# Altium schematic sheet Motors.SchDoc
size A1; SheetNumber: 3; SheetTotal: 4
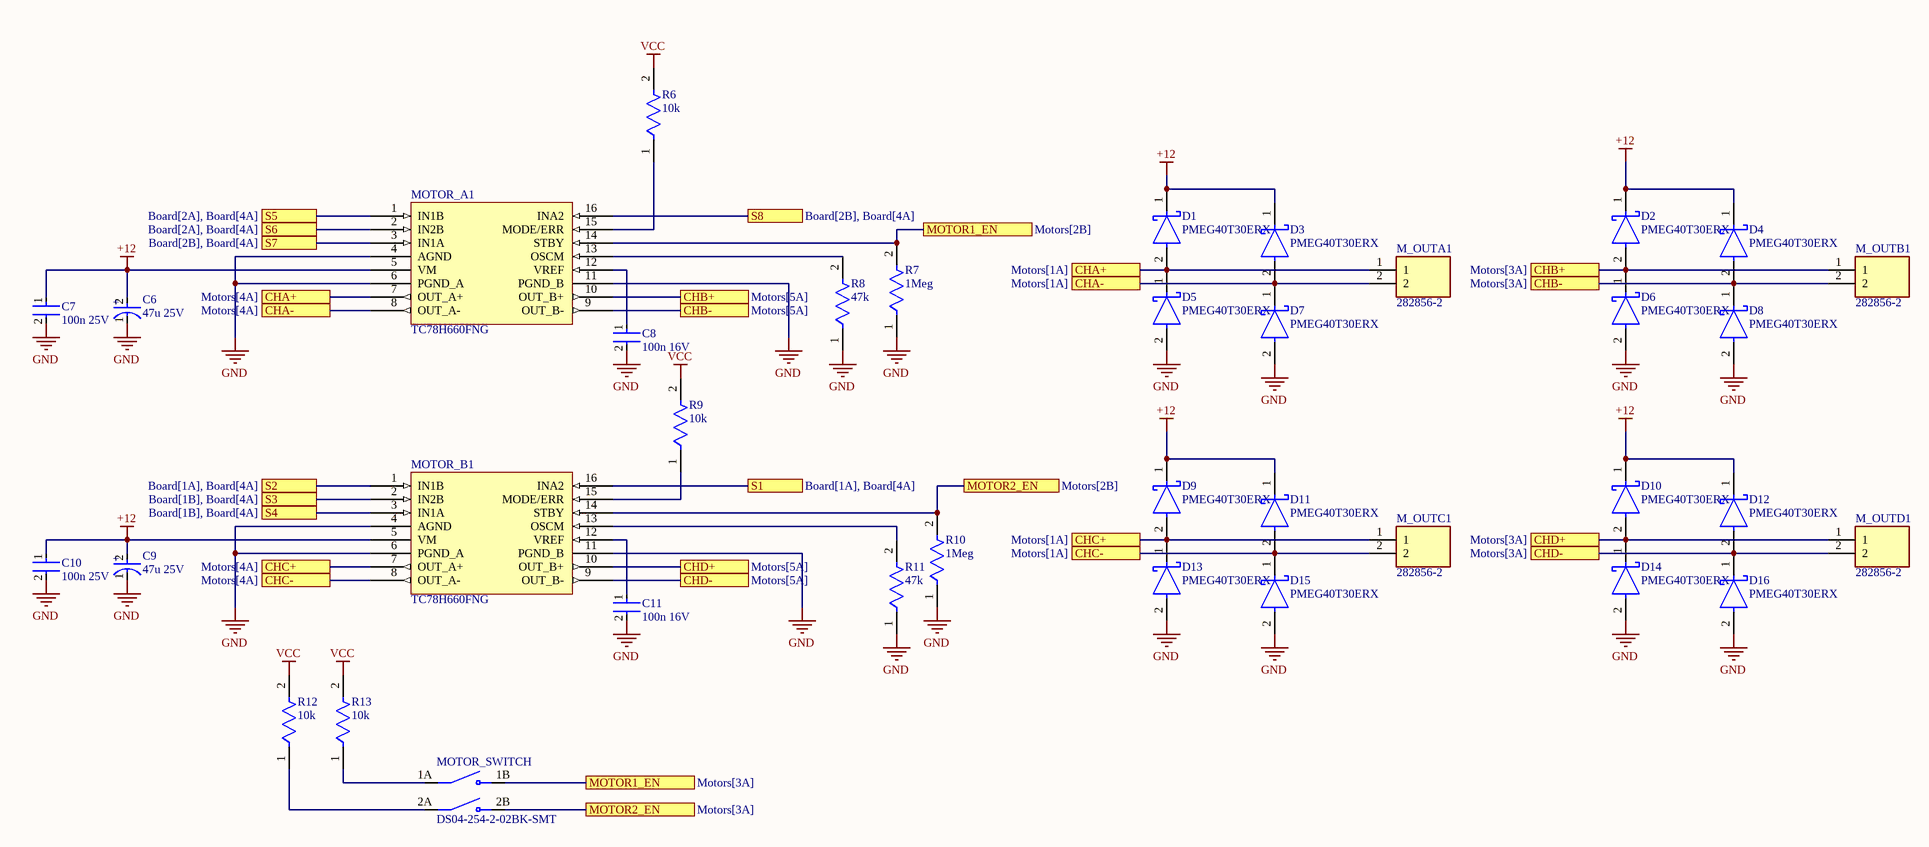
[diagram p0: Motors.SchDoc]

## Parts
C6  47u 25V  [FP-T491D476K025AT-MFG]
C7  100n 25V  [FP-C0402-BB-MFG]
C8  100n 16V  [FP-C0402-BB-MFG]
C9  47u 25V  [FP-T491D476K025AT-MFG]
C10  100n 25V  [FP-C0402-BB-MFG]
C11  100n 16V  [FP-C0402-BB-MFG]
D1  PMEG40T30ERX  [FP-SOD123-IPC_A]
D2  PMEG40T30ERX  [FP-SOD123-IPC_A]
D3  PMEG40T30ERX  [FP-SOD123-IPC_A]
D4  PMEG40T30ERX  [FP-SOD123-IPC_A]
D5  PMEG40T30ERX  [FP-SOD123-IPC_A]
D6  PMEG40T30ERX  [FP-SOD123-IPC_A]
D7  PMEG40T30ERX  [FP-SOD123-IPC_A]
D8  PMEG40T30ERX  [FP-SOD123-IPC_A]
D9  PMEG40T30ERX  [FP-SOD123-IPC_A]
D10  PMEG40T30ERX  [FP-SOD123-IPC_A]
D11  PMEG40T30ERX  [FP-SOD123-IPC_A]
D12  PMEG40T30ERX  [FP-SOD123-IPC_A]
D13  PMEG40T30ERX  [FP-SOD123-IPC_A]
D14  PMEG40T30ERX  [FP-SOD123-IPC_A]
D15  PMEG40T30ERX  [FP-SOD123-IPC_A]
D16  PMEG40T30ERX  [FP-SOD123-IPC_A]
M_OUTA1  282856-2  [TE_282856-2]
M_OUTB1  282856-2  [TE_282856-2]
M_OUTC1  282856-2  [TE_282856-2]
M_OUTD1  282856-2  [TE_282856-2]
MOTOR_A1  TC78H660FNG  [TSOP65P640X120-16N]
MOTOR_B1  TC78H660FNG  [TSOP65P640X120-16N]
MOTOR_SWITCH  DS04-254-2-02BK-SMT  [SW_DS04-254-2-02BK-SMT]
R6  10k  [FP-CRCW0402-e3-IPC_C]
R7  1Meg  [FP-CRCW0402-e3-IPC_C]
R8  47k  [FP-CRCW0402-e3-IPC_C]
R9  10k  [FP-CRCW0402-e3-IPC_C]
R10  1Meg  [FP-CRCW0402-e3-IPC_C]
R11  47k  [FP-CRCW0402-e3-IPC_C]
R12  10k  [FP-CRCW0402-e3-IPC_C]
R13  10k  [FP-CRCW0402-e3-IPC_C]

## Ports
CHA+ (see Motors[1A]), CHA+ (see Motors[4A]), CHA- (see Motors[1A]), CHA- (see Motors[4A]), CHB+ (see Motors[3A]), CHB+ (see Motors[5A]), CHB- (see Motors[3A]), CHB- (see Motors[5A]), CHC+ (see Motors[1A]), CHC+ (see Motors[4A]), CHC- (see Motors[1A]), CHC- (see Motors[4A]), CHD+ (see Motors[3A]), CHD+ (see Motors[5A]), CHD- (see Motors[3A]), CHD- (see Motors[5A]), MOTOR1_EN (see Motors[2B]), MOTOR1_EN (see Motors[3A]), MOTOR2_EN (see Motors[2B]), MOTOR2_EN (see Motors[3A]), S1 (see Board[1A], Board[4A]), S2 (see Board[1A], Board[4A]), S3 (see Board[1B], Board[4A]), S4 (see Board[1B], Board[4A]), S5 (see Board[2A], Board[4A]), S6 (see Board[2A], Board[4A]), S7 (see Board[2B], Board[4A]), S8 (see Board[2B], Board[4A])

## Nets
+12: C6.2(A) C7.1 C9.2(A) C10.1 D1.1(C) D2.1(C) D3.1(C) D4.1(C) D9.1(C) D10.1(C) D11.1(C) D12.1(C) MOTOR_A1.5(VM) MOTOR_B1.5(VM)
GND: C6.1(C) C7.2 C8.2 C9.1(C) C10.2 C11.2 D5.2(A) D6.2(A) D7.2(A) D8.2(A) D13.2(A) D14.2(A) D15.2(A) D16.2(A) MOTOR_A1.4(AGND) MOTOR_A1.6(PGND_A) MOTOR_A1.11(PGND_B) MOTOR_B1.4(AGND) MOTOR_B1.6(PGND_A) MOTOR_B1.11(PGND_B) R7.1 R8.1 R10.1 R11.1
VCC: R6.2 R9.2 R12.2 R13.2
CHA+: D1.2(A) D5.1(C) M_OUTA1.1 MOTOR_A1.7(OUT_A+) ; port CHA+
CHA-: D3.2(A) D7.1(C) M_OUTA1.2 MOTOR_A1.8(OUT_A-) ; port CHA-
CHB+: D2.2(A) D6.1(C) M_OUTB1.1 MOTOR_A1.10(OUT_B+) ; port CHB+
CHB-: D4.2(A) D8.1(C) M_OUTB1.2 MOTOR_A1.9(OUT_B-) ; port CHB-
CHC+: D9.2(A) D13.1(C) M_OUTC1.1 MOTOR_B1.7(OUT_A+) ; port CHC+
CHC-: D11.2(A) D15.1(C) M_OUTC1.2 MOTOR_B1.8(OUT_A-) ; port CHC-
CHD+: D10.2(A) D14.1(C) M_OUTD1.1 MOTOR_B1.10(OUT_B+) ; port CHD+
CHD-: D12.2(A) D16.1(C) M_OUTD1.2 MOTOR_B1.9(OUT_B-) ; port CHD-
MOTOR1_EN: MOTOR_A1.14(STBY) MOTOR_SWITCH.1B(NO1) R7.2 ; port MOTOR1_EN
MOTOR2_EN: MOTOR_B1.14(STBY) MOTOR_SWITCH.2B(NO2) R10.2 ; port MOTOR2_EN
S1: MOTOR_B1.16(INA2) ; port S1
S2: MOTOR_B1.1(IN1B) ; port S2
S3: MOTOR_B1.2(IN2B) ; port S3
S4: MOTOR_B1.3(IN1A) ; port S4
S5: MOTOR_A1.1(IN1B) ; port S5
S6: MOTOR_A1.2(IN2B) ; port S6
S7: MOTOR_A1.3(IN1A) ; port S7
S8: MOTOR_A1.16(INA2) ; port S8
NetC8_1: C8.1 MOTOR_A1.12(VREF)
NetC11_1: C11.1 MOTOR_B1.12(VREF)
NetMOTOR_A1_13: MOTOR_A1.13(OSCM) R8.2
NetMOTOR_A1_15: MOTOR_A1.15(MODE/ERR) R6.1
NetMOTOR_B1_13: MOTOR_B1.13(OSCM) R11.2
NetMOTOR_B1_15: MOTOR_B1.15(MODE/ERR) R9.1
NetMOTOR_SWITCH_1A: MOTOR_SWITCH.1A(COM1) R13.1
NetMOTOR_SWITCH_2A: MOTOR_SWITCH.2A(COM2) R12.1

## Notes on the sheet
- (in symbol CMP-03017-000020-1) +

## Library data of the parts
C6 C9 = CMP-03017-000020-1: CAP TANT 47UF 10% 25V 2917; Dielectric Material: Tantalum; Life (Hours): 2000Hour; Ripple Current: 463mA; Leakage Current: 11.8uA; Polarity: Polar; ESR (Equivalent Series Resistance): 700mR; Height - Seated (Max): 0.122inch; Package Quantity: 1; Max Operating Temperature: 125°C; Failure Rate: 0.001%; Height: 2.8mm; Voltage Rating (DC): 25V; Dissipation Factor: 10%; Mount: Surface Mount; Min Operating Temperature: -55°C; Packaging: Tape and Reel; Radiation Hardening: No; Case Code (Metric): 7343; Features: General Purpose; Voltage: 25V; Case/Package: 2917; Capacitance: 47uF; Case Code (Imperial): 2917; Tolerance: 10%; Number of Pins: 2; Weight: 0.023634oz; REACH SVHC: No SVHC; RoHS Compliant: Yes; Length: 7.3mm; Depth: 4.3mm; Lead Free: Lead Free; Width: 4.3mm; Voltage Rating: 25V; Termination: SMD/SMT
C7 C8 C10 C11 = CMP-2008-02108-2: CAP CER 0.1UF 16V X7R 0402; Manufacturer: Kemet; Manufacturer Part Number: C0402C104K4RACTU; Value: 0.10 μF; Tolerance: 0.1; Material: Ceramic; Temperature Coefficient: 15%; Voltage Rating: 16 V; Package: C0402-BB; Automotive: No; Ipc Land Pattern Name: CAPC10050X50; Device Class L3: Ceramic Capacitors; Capacitance: 0.10 μF; Octopart: https://octopart.com/c0402c104k4ractu-kemet-94158; Temperature Characteristic: X7R; Mouser Description: Cap Ceramic 0.1uF 16V X7R 10% SMD 0402 125?C Paper T/R - Tape and Reel (Alt: C0402C104K4RAC TU); ComponentLink2Description: Datasheet; Temperature Range Low: -55°C; RoHS: TRUE; Device Class L1: Passive Components; Temperature Range High: +125°C; Device Class L2: Capacitors; ComponentLink2URL: https://content.kemet.com/datasheets/KEM_C1002_X7R_SMD.pdf; Category: Cap; Height: 0.55mm; Temperature: -55°C to +125°C; Lead Free: Yes; Digikey Description: CAP CER 0.1UF 16V X7R 0402
D1-D16 = CMP-0303-00003-3: DIODE SCHOTTKY 40V 1A SOD123; Forward Voltage: 450mV; Capacitance: 110pF; Max Forward Surge Current (Ifsm): 25A; Peak Reverse Current: 50uA; Polarity: Standard; Element Configuration: Single; Max Power Dissipation: 450mW; Min Operating Temperature: -65°C; Package Quantity: 3000; Contact Plating: Tin; Weight: 0.000353oz; Max Repetitive Reverse Voltage (Vrrm): 40V; Max Reverse Voltage (DC): 40V; Height: 1.25mm; Average Rectified Current: 1A; Width: 1.7mm; Case/Package: SOD-123-2; Lead Free: Lead Free; Max Operating Temperature: 125°C; Current Rating: 1A; Termination: SMD/SMT; Forward Current: 1A; Radiation Hardening: No; Number of Pins: 2; Length: 2.85mm; Voltage Rating (DC): 40V; REACH SVHC: No SVHC; Peak Non-Repetitive Surge Current: 25A; Packaging: Tape and Reel; Output Current: 1A
M_OUTA1 M_OUTB1 M_OUTC1 M_OUTD1 = CMP-036-000000-1: TERMI-BLOK PCB MOUNT 2P; MF: TE Connectivity; Design Item ID: 282856-2; Component Type: Standard; Package: None; Value: *; EU_RoHS_Compliance: Compliant with Exemptions; SnapEDA_Link: https://www.snapeda.com/parts/282856-2/TE%20Connectivity%20AMP%20Connectors/view-part/1809079/?ref=snap; Digi-Key_Purchase_URL: https://www.digikey.com/product-detail/en/te-connectivity-amp-connectors/1-282856-2/A98108-ND/1826971?utm_source=snapeda&utm_medium=aggregator&utm_campaign=symbol; Digi-Key_Part_Number: A98108-ND; TE_purchase_URL: https://www.te.com/usa-en/product-282856-2.html?te_bu=Cor&te_type=disp&te_campaign=seda_glo_cor-seda-global-disp-prtnr-fy19-seda-model-bom-cta_sma-317_1&elqCampaignId=32493; Pin Count: 2; MP: 282856-2; Source: SnapEDAsch.SchLib
MOTOR_A1 MOTOR_B1 = CMP-024-00000-1: Toshiba two channel dc motor driver , 2A for each channel.
MOTOR_SWITCH = CMP-038-000000-1: 2 Position, Surface Mount, 2.54 mm Pitch, Flat Slide Actuator, Flat Bottom, SMT Pin, DIP Switch; MF: CUI Devices; Value: *; SnapEDA_Link: https://www.snapeda.com/parts/DS04-254-2-02BK-SMT/CUI+Devices/view-part/?ref=snap; Digi-Key_Part_Number: 2223-DS04-254-2-02BK-SMT-ND; CUI_purchase_URL: https://www.cuidevices.com/product/switches/dip-switches/ds04-254-smt-series?utm_source=snapeda.com&utm_medium=referral&utm_campaign=snapedaBOM; Package: None; Purchase-URL: https://pricing.snapeda.com/search/part/DS04-254-2-02BK-SMT/?ref=eda; MP: DS04-254-2-02BK-SMT; Source: DS04-254-2-02BK-SMT.SchLib; Pin Count: 4; Design Item ID: DS04-254-2-02BK-SMT; Component Type: Standard; Check_prices: https://www.snapeda.com/parts/DS04-254-2-02BK-SMT/CUI+Devices/view-part/?ref=eda
R6-R13 = CMP-2002-08122-2: RES Thick Film, 0Ω, 0.063W, 0402; Tolerance: 5%; Max Power Dissipation: 63mW; Voltage Rating: 50V; Temperature Coefficient: 100ppm/°C; Resistance: 0mR; Contact Plating: Tin; Height: 0.35mm; Radiation Hardening: No; Features: Automotive AEC-Q200; Composition: Thick Film; Width: 0.5mm; Weight: 2.3E-05oz; Termination: SMD/SMT; Packaging: Tape and Reel; Mount: Surface Mount; Case Code (Metric): 1005; Military Standard: Not; Min Operating Temperature: -55°C; Number of Terminations: 2; Package Quantity: 1; Case Code (Imperial): 0402; Depth: 0.5mm; Max Operating Temperature: 155°C; Case/Package: 0402; Power Rating: 63mW; Lead Free: Lead Free; Voltage Rating (DC): 50V; Length: 1mm